# Altium schematic sheet Audio-Beamformer_LED_V1.0.SchDoc: Audio-Beamformer
size A4; PageSetup: Record=PageOptions|CenterHorizontal=True|CenterVertical=True|PrintScale=0.97|XCorrection=1.00|YCorrection=1.00|PrintKind=0|BorderSize=5000000|LeftOffset=0|BottomOffset=0|Orientation=2|PaperLength=1000|PaperWidth=1000|Scale=100|PaperSource=7|PrintQuality=-3|MediaType=1|DitherType=10|PrintScaleMode=1|PaperKind=A4|PaperIndex=9; Organization: Ostschweizer Fachhochschule; Address2: Florian Baumgartner & Thierry Schwaller; Address3: florian.baumgartner@ost.ch; DocumentNumber: 9; Revision: V1.0; SheetNumber: 9; SheetTotal: 10; Author: Florian Baumgartner & Thierry Schwaller; Subtitle: LEDs
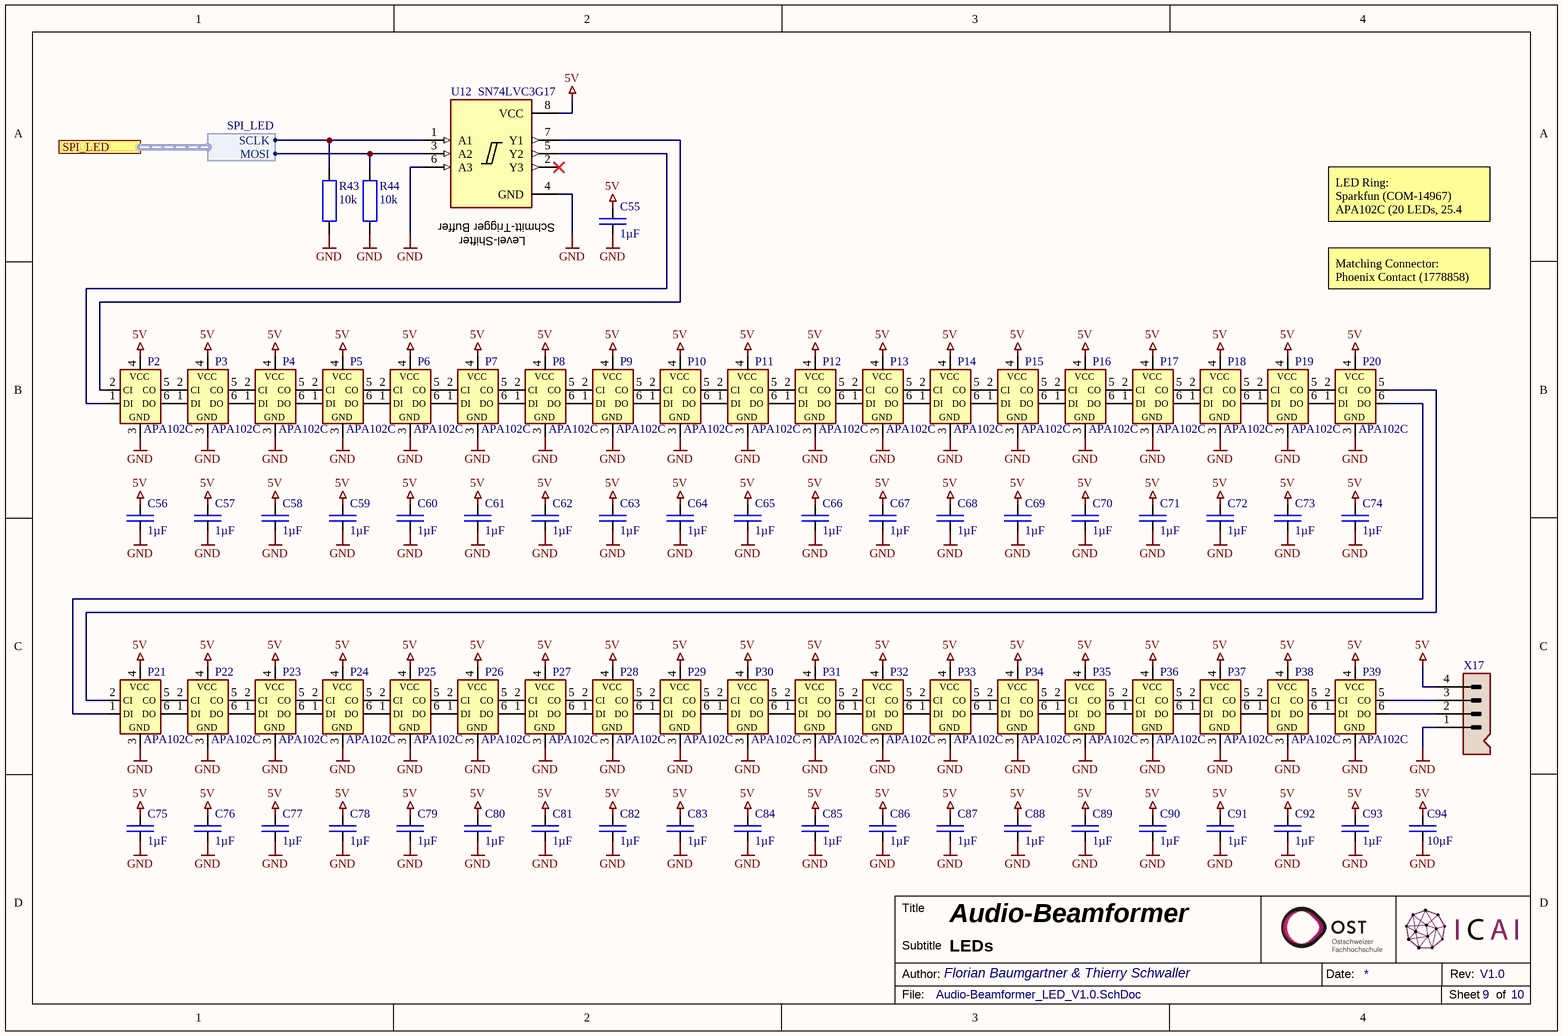
[diagram p0: Audio-Beamformer_LED_V1.0.SchDoc]

## Parts
C55  1µF  [SMD Keramikkondensator 0603]
C56  1µF  [SMD Keramikkondensator 0603]
C57  1µF  [SMD Keramikkondensator 0603]
C58  1µF  [SMD Keramikkondensator 0603]
C59  1µF  [SMD Keramikkondensator 0603]
C60  1µF  [SMD Keramikkondensator 0603]
C61  1µF  [SMD Keramikkondensator 0603]
C62  1µF  [SMD Keramikkondensator 0603]
C63  1µF  [SMD Keramikkondensator 0603]
C64  1µF  [SMD Keramikkondensator 0603]
C65  1µF  [SMD Keramikkondensator 0603]
C66  1µF  [SMD Keramikkondensator 0603]
C67  1µF  [SMD Keramikkondensator 0603]
C68  1µF  [SMD Keramikkondensator 0603]
C69  1µF  [SMD Keramikkondensator 0603]
C70  1µF  [SMD Keramikkondensator 0603]
C71  1µF  [SMD Keramikkondensator 0603]
C72  1µF  [SMD Keramikkondensator 0603]
C73  1µF  [SMD Keramikkondensator 0603]
C74  1µF  [SMD Keramikkondensator 0603]
C75  1µF  [SMD Keramikkondensator 0603]
C76  1µF  [SMD Keramikkondensator 0603]
C77  1µF  [SMD Keramikkondensator 0603]
C78  1µF  [SMD Keramikkondensator 0603]
C79  1µF  [SMD Keramikkondensator 0603]
C80  1µF  [SMD Keramikkondensator 0603]
C81  1µF  [SMD Keramikkondensator 0603]
C82  1µF  [SMD Keramikkondensator 0603]
C83  1µF  [SMD Keramikkondensator 0603]
C84  1µF  [SMD Keramikkondensator 0603]
C85  1µF  [SMD Keramikkondensator 0603]
C86  1µF  [SMD Keramikkondensator 0603]
C87  1µF  [SMD Keramikkondensator 0603]
C88  1µF  [SMD Keramikkondensator 0603]
C89  1µF  [SMD Keramikkondensator 0603]
C90  1µF  [SMD Keramikkondensator 0603]
C91  1µF  [SMD Keramikkondensator 0603]
C92  1µF  [SMD Keramikkondensator 0603]
C93  1µF  [SMD Keramikkondensator 0603]
C94  10µF  [SMD Keramikkondensator 1206]
P2  APA102C  [SMD LED APA102C-5050]
P3  APA102C  [SMD LED APA102C-5050]
P4  APA102C  [SMD LED APA102C-5050]
P5  APA102C  [SMD LED APA102C-5050]
P6  APA102C  [SMD LED APA102C-5050]
P7  APA102C  [SMD LED APA102C-5050]
P8  APA102C  [SMD LED APA102C-5050]
P9  APA102C  [SMD LED APA102C-5050]
P10  APA102C  [SMD LED APA102C-5050]
P11  APA102C  [SMD LED APA102C-5050]
P12  APA102C  [SMD LED APA102C-5050]
P13  APA102C  [SMD LED APA102C-5050]
P14  APA102C  [SMD LED APA102C-5050]
P15  APA102C  [SMD LED APA102C-5050]
P16  APA102C  [SMD LED APA102C-5050]
P17  APA102C  [SMD LED APA102C-5050]
P18  APA102C  [SMD LED APA102C-5050]
P19  APA102C  [SMD LED APA102C-5050]
P20  APA102C  [SMD LED APA102C-5050]
P21  APA102C  [SMD LED APA102C-5050]
P22  APA102C  [SMD LED APA102C-5050]
P23  APA102C  [SMD LED APA102C-5050]
P24  APA102C  [SMD LED APA102C-5050]
P25  APA102C  [SMD LED APA102C-5050]
P26  APA102C  [SMD LED APA102C-5050]
P27  APA102C  [SMD LED APA102C-5050]
P28  APA102C  [SMD LED APA102C-5050]
P29  APA102C  [SMD LED APA102C-5050]
P30  APA102C  [SMD LED APA102C-5050]
P31  APA102C  [SMD LED APA102C-5050]
P32  APA102C  [SMD LED APA102C-5050]
P33  APA102C  [SMD LED APA102C-5050]
P34  APA102C  [SMD LED APA102C-5050]
P35  APA102C  [SMD LED APA102C-5050]
P36  APA102C  [SMD LED APA102C-5050]
P37  APA102C  [SMD LED APA102C-5050]
P38  APA102C  [SMD LED APA102C-5050]
P39  APA102C  [SMD LED APA102C-5050]
R43  10k  [SMD Widerstand 0603]
R44  10k  [SMD Widerstand 0603]
U12  SN74LVC3G17  [SMD IC SM-8]
X17  Board-To-Wire Connector (Receptacle)  [THT Connector 2.5mm 4-Pol (1778641)]  (value not drawn)

## Ports
SPI_LED (harness SPI_LED)

## Harnesses
SPI_LED: SCLK, MOSI

## Nets
5V: C55.2 C56.2 C57.2 C58.2 C59.2 C60.2 C61.2 C62.2 C63.2 C64.2 C65.2 C66.2 C67.2 C68.2 C69.2 C70.2 C71.2 C72.2 C73.2 C74.2 C75.2 C76.2 C77.2 C78.2 C79.2 C80.2 C81.2 C82.2 C83.2 C84.2 C85.2 C86.2 C87.2 C88.2 C89.2 C90.2 C91.2 C92.2 C93.2 C94.2 P2.4(VCC) P3.4(VCC) P4.4(VCC) P5.4(VCC) P6.4(VCC) P7.4(VCC) P8.4(VCC) P9.4(VCC) P10.4(VCC) P11.4(VCC) P12.4(VCC) P13.4(VCC) P14.4(VCC) P15.4(VCC) P16.4(VCC) P17.4(VCC) P18.4(VCC) P19.4(VCC) P20.4(VCC) P21.4(VCC) P22.4(VCC) P23.4(VCC) P24.4(VCC) P25.4(VCC) P26.4(VCC) P27.4(VCC) P28.4(VCC) P29.4(VCC) P30.4(VCC) P31.4(VCC) P32.4(VCC) P33.4(VCC) P34.4(VCC) P35.4(VCC) P36.4(VCC) P37.4(VCC) P38.4(VCC) P39.4(VCC) U12.8(VCC) X17.4
GND: C55.1 C56.1 C57.1 C58.1 C59.1 C60.1 C61.1 C62.1 C63.1 C64.1 C65.1 C66.1 C67.1 C68.1 C69.1 C70.1 C71.1 C72.1 C73.1 C74.1 C75.1 C76.1 C77.1 C78.1 C79.1 C80.1 C81.1 C82.1 C83.1 C84.1 C85.1 C86.1 C87.1 C88.1 C89.1 C90.1 C91.1 C92.1 C93.1 C94.1 P2.3(GND) P3.3(GND) P4.3(GND) P5.3(GND) P6.3(GND) P7.3(GND) P8.3(GND) P9.3(GND) P10.3(GND) P11.3(GND) P12.3(GND) P13.3(GND) P14.3(GND) P15.3(GND) P16.3(GND) P17.3(GND) P18.3(GND) P19.3(GND) P20.3(GND) P21.3(GND) P22.3(GND) P23.3(GND) P24.3(GND) P25.3(GND) P26.3(GND) P27.3(GND) P28.3(GND) P29.3(GND) P30.3(GND) P31.3(GND) P32.3(GND) P33.3(GND) P34.3(GND) P35.3(GND) P36.3(GND) P37.3(GND) P38.3(GND) P39.3(GND) R43.1 R44.1 U12.4(GND) U12.6(A3) X17.1
NetP2_1: P2.1(DI) U12.5(Y2)
NetP2_2: P2.2(CI) U12.7(Y1)
NetP2_5: P2.5(CO) P3.2(CI)
NetP2_6: P2.6(DO) P3.1(DI)
NetP3_5: P3.5(CO) P4.2(CI)
NetP3_6: P3.6(DO) P4.1(DI)
NetP4_5: P4.5(CO) P5.2(CI)
NetP4_6: P4.6(DO) P5.1(DI)
NetP5_5: P5.5(CO) P6.2(CI)
NetP5_6: P5.6(DO) P6.1(DI)
NetP6_5: P6.5(CO) P7.2(CI)
NetP6_6: P6.6(DO) P7.1(DI)
NetP7_5: P7.5(CO) P8.2(CI)
NetP7_6: P7.6(DO) P8.1(DI)
NetP8_5: P8.5(CO) P9.2(CI)
NetP8_6: P8.6(DO) P9.1(DI)
NetP9_5: P9.5(CO) P10.2(CI)
NetP9_6: P9.6(DO) P10.1(DI)
NetP10_5: P10.5(CO) P11.2(CI)
NetP10_6: P10.6(DO) P11.1(DI)
NetP11_5: P11.5(CO) P12.2(CI)
NetP11_6: P11.6(DO) P12.1(DI)
NetP12_5: P12.5(CO) P13.2(CI)
NetP12_6: P12.6(DO) P13.1(DI)
NetP13_5: P13.5(CO) P14.2(CI)
NetP13_6: P13.6(DO) P14.1(DI)
NetP14_5: P14.5(CO) P15.2(CI)
NetP14_6: P14.6(DO) P15.1(DI)
NetP15_5: P15.5(CO) P16.2(CI)
NetP15_6: P15.6(DO) P16.1(DI)
NetP16_5: P16.5(CO) P17.2(CI)
NetP16_6: P16.6(DO) P17.1(DI)
NetP17_5: P17.5(CO) P18.2(CI)
NetP17_6: P17.6(DO) P18.1(DI)
NetP18_5: P18.5(CO) P19.2(CI)
NetP18_6: P18.6(DO) P19.1(DI)
NetP19_5: P19.5(CO) P20.2(CI)
NetP19_6: P19.6(DO) P20.1(DI)
NetP20_5: P20.5(CO) P21.2(CI)
NetP20_6: P20.6(DO) P21.1(DI)
NetP21_5: P21.5(CO) P22.2(CI)
NetP21_6: P21.6(DO) P22.1(DI)
NetP22_5: P22.5(CO) P23.2(CI)
NetP22_6: P22.6(DO) P23.1(DI)
NetP23_5: P23.5(CO) P24.2(CI)
NetP23_6: P23.6(DO) P24.1(DI)
NetP24_5: P24.5(CO) P25.2(CI)
NetP24_6: P24.6(DO) P25.1(DI)
NetP25_5: P25.5(CO) P26.2(CI)
NetP25_6: P25.6(DO) P26.1(DI)
NetP26_5: P26.5(CO) P27.2(CI)
NetP26_6: P26.6(DO) P27.1(DI)
NetP27_5: P27.5(CO) P28.2(CI)
NetP27_6: P27.6(DO) P28.1(DI)
NetP28_5: P28.5(CO) P29.2(CI)
NetP28_6: P28.6(DO) P29.1(DI)
NetP29_5: P29.5(CO) P30.2(CI)
NetP29_6: P29.6(DO) P30.1(DI)
NetP30_5: P30.5(CO) P31.2(CI)
NetP30_6: P30.6(DO) P31.1(DI)
NetP31_5: P31.5(CO) P32.2(CI)
NetP31_6: P31.6(DO) P32.1(DI)
NetP32_5: P32.5(CO) P33.2(CI)
NetP32_6: P32.6(DO) P33.1(DI)
NetP33_5: P33.5(CO) P34.2(CI)
NetP33_6: P33.6(DO) P34.1(DI)
NetP34_5: P34.5(CO) P35.2(CI)
NetP34_6: P34.6(DO) P35.1(DI)
NetP35_5: P35.5(CO) P36.2(CI)
NetP35_6: P35.6(DO) P36.1(DI)
NetP36_5: P36.5(CO) P37.2(CI)
NetP36_6: P36.6(DO) P37.1(DI)
NetP37_5: P37.5(CO) P38.2(CI)
NetP37_6: P37.6(DO) P38.1(DI)
NetP38_5: P38.5(CO) P39.2(CI)
NetP38_6: P38.6(DO) P39.1(DI)
NetP39_5: P39.5(CO) X17.3
NetP39_6: P39.6(DO) X17.2
NetR43_2: R43.2 U12.1(A1) ; port SPI_LED.SCLK
NetR44_2: R44.2 U12.3(A2) ; port SPI_LED.MOSI

Not connected (* = marked no-connect by the designer): U12 2(Y3)*

## Notes on the sheet
- Schmitt-Trigger Buffer
- (near U12) Level-Shifter
- LED Ring:
  Sparkfun (COM-14967)
  APA102C (20 LEDs, 25.4 mm)
- Matching Connector:
  Phoenix Contact (1778858)
- Title
- Author:
- Subtitle
- Date:
- Rev:
- File:
- Sheet
- of

## Library data of the parts
C55-C93 = C-CAPACITOR: CAP-MK; Component Description: Multilayer Ceramic Capacitors; Component Value: 1µF 50V; Digikey: 1276-1860-1-ND; Farnell: 3013383; Mouser: 187-CL10A105KB8NNNC; JLC-Parts: C15849; Unit Price: 0.01
C94 = C-CAPACITOR: CAP-MK; Component Description: Multilayer Ceramic Capacitors; Component Value: 10µF 50V; Digikey: 445-7886-1-ND; Farnell: 2211092; Mouser: 810-CGA5L3X5R1H106K; JLC-Parts: C13585; Unit Price: 0.27
P2-P39 = P-APA102C: Smart RGB-LED; Digikey: 1568-COM-16345-ND; Mouser: 474-COM-16345; ComponentLink1Description: Datasheet; ComponentLink1URL: https://cdn.sparkfun.com/datasheets/Components/LED/APA102C.pdf; Component Description: Smart RGB-LED; Component Value: APA102C; Unit Price: 0.35
R43 R44 = R-RESISTOR: RES (E=Heizwiderstand B=Messwandler); Component Description: Thick Film Chip Resistor; Component Value: 10k (75V, 100mW, 1%); Digikey: P10.0KHCT-ND; Farnell: 2303192; Mouser: 667-ERJ-3EKF1002V; JLC-Parts: C25804; Unit Price: 0.01
U12 = U-SN74LVC3G17DCTR: Tripple Schmitt-Trigger Buffer; Digikey: 296-16915-1-ND; Farnell: 595-SN74LVC3G17DCTR; Mouser: 595-SN74LVC3G17DCTR; Component Description: Tripple Schmitt-Trigger Buffer; ComponentLink1Description: Datasheet; ComponentLink1URL: https://datasheet.lcsc.com/lcsc/1809081631_Texas-Instruments-SN74LVC3G17DCTR_C18213.pdf; Component Value: SN74LVC3G17DCTR; JLC-Parts: C18213; Unit Price: 0.70
X17 = X-Stiftleiste (4-Fach): Component Value: PTSM 0,5/ 4-HH-2,5-THR R32; Digikey: 277-2310-1-ND; Farnell: 3240558; Mouser: 651-1778641; Component Description: Board-To-Wire Connector (Receptacle); ComponentLink1Description: Datasheet; ComponentLink1URL: https://4donline.ihs.com/images/VipMasterIC/IC/PCON/PCONS21961/PCONS22028-1.pdf?hkey=52A5661711E402568146F3353EA87419; Unit Price: 0.74